# EAGLE design usb2serial (EAGLE 5.06)
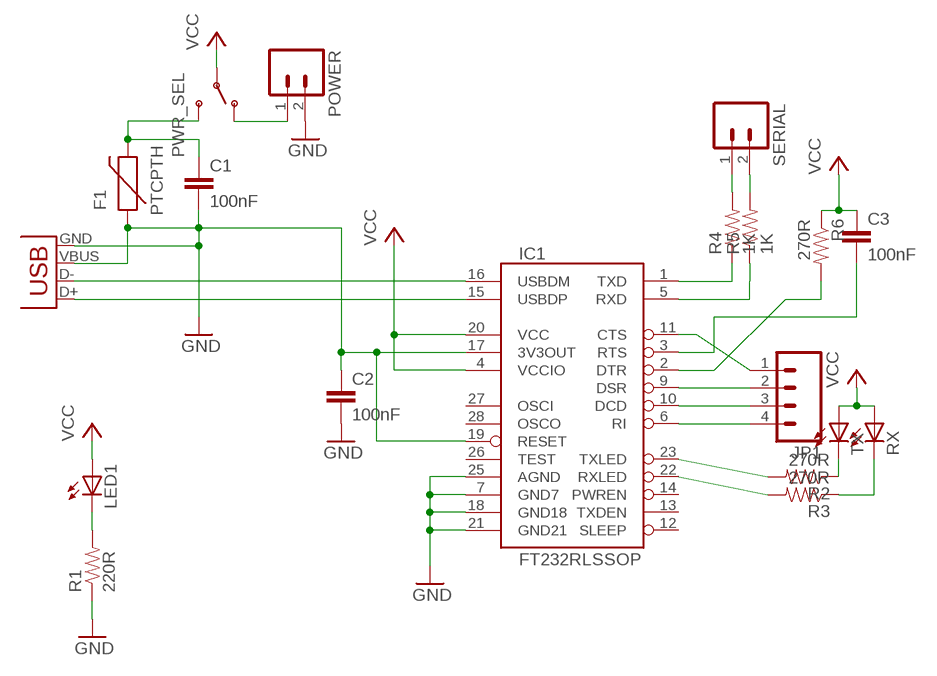
[diagram p0: schematic, sheet 1]

## Parts
C1  100nF  CAPPTH  [CAP-PTH-SMALL]
C2  100nF  CAPPTH  [CAP-PTH-SMALL]
C3  100nF  CAPPTH  [CAP-PTH-SMALL]
F1  PTCPTH  [PTC]
IC1  FT232RLSSOP  [SSOP28DB]
JP1  M04LOCK  [1X04_LOCK]
LED1  LED5MM  [LED5MM]
POWER  M02LOCK  [1X02_LOCK]
PWR_SEL  SWITCH-SPSTPTH_LOCK  [SWITCH-SPDT_LOCK.007S]
R1  220R  RESISTORPTH1  [AXIAL-0.3]
R2  270R  RESISTORPTH1  [AXIAL-0.3]
R3  270R  RESISTORPTH1  [AXIAL-0.3]
R4  1K  RESISTORPTH1  [AXIAL-0.3]
R5  1K  RESISTORPTH1  [AXIAL-0.3]
R6  270R  RESISTORPTH1  [AXIAL-0.3]
RX  LED5MM  [LED5MM]
SERIAL  M02LOCK  [1X02_LOCK]
TX  LED5MM  [LED5MM]
X1  USBSMD  [USB-MINIB]

## Nets
GND: C1.2 C2.1 C2.2 F1.P$1 IC1.7(GND7) IC1.17(3V3OUT) IC1.18(GND18) IC1.19(RESET) IC1.21(GND21) IC1.25(AGND) POWER.2 R1.P$1 X1.GND X1.VBUS
N$1: IC1.15(USBDP) X1.D+
N$2: IC1.16(USBDM) X1.D-
N$3: C1.1 F1.P$2 PWR_SEL.3(S)
N$4: R4.P$2 SERIAL.1
N$5: POWER.1 PWR_SEL.1(O)
N$6: R5.P$2 SERIAL.2
N$7: LED1.K(C) R1.P$2
N$9: C3.2 IC1.3(RTS)
N$10: IC1.22(RXLED) R3.P$2
N$11: IC1.23(TXLED) R2.P$2
N$12: IC1.2(DTR) R6.P$2
N$13: R2.P$1 TX.K(C)
N$14: R3.P$1 RX.K(C)
N$15: IC1.1(TXD) R4.P$1
N$16: IC1.5(RXD) R5.P$1
N$17: IC1.11(CTS) JP1.1
N$18: IC1.6(RI) JP1.4
N$19: IC1.10(DCD) JP1.3
N$20: IC1.9(DSR) JP1.2
VCC: C3.1 IC1.4(VCCIO) IC1.20(VCC) LED1.A PWR_SEL.2(P) R6.P$1 RX.A TX.A
Unconnected: IC1.12(SLEEP) IC1.13(TXDEN) IC1.14(PWREN) IC1.26(TEST) IC1.27(OSCI) IC1.28(OSCO)

## Library data of the parts
C1-C3 = SparkFun:CAP: Capacitor Standard 0603 ceramic capacitor, and 0.1" leaded capacitor.
F1 = SparkFun:PTC: Resettable Fuse PTC Resettable Fuse. Spark Fun Electronics SKU : COM-08357
IC1 = SparkFun:FT232RL: USB UART FT232RL 4th Generation USB UART (USB <-> Serial) Controller. Spark Fun Electronics SKU : COM-00650
JP1 = SparkFun:M04: Header 4 Standard 4-pin 0.1" header. Use with straight break away headers (SKU : PRT-00116), right angle break away headers (PRT-00553), swiss pins (PRT-00743), machine pins (PRT-00117), and female headers (PRT-00115). Molex polarized connector foot print use with SKU : PRT-08231 with associated crimp pins and housings.
LED1 RX TX = led:LED: LED OSRAM: - CHIPLED LG R971, LG N971, LY N971, LG Q971, LY Q971, LO R971, LY R971 LH N974, LH R974 LS Q976, LO Q976, LY Q976 LO Q996 - Hyper CHIPLED LW Q18S LB Q993, LB Q99A, LB R99A - SideLED LS A670, LO A670, LY A670, LG A670, LP A670 LB A673, LV A673, LT A673, LW A673 LH A674 LY A675 LS A676, LA A676, LO A676, LY A676, LW A676 LS A679, LY A679, LG A679 - Hyper Micro SIDELED® LS Y876, LA Y876, LO Y876, LY Y876 LT Y87S - SmartLED LW L88C, LW L88S LB L89C, LB L89S, LG L890 LS L89K, LO L89K, LY L89K LS L896, LA L896, LO L896, LY L896 - TOPLED LS T670, LO T670, LY T670, LG T670, LP T670 LSG T670, LSP T670, LSY T670, LOP T670, LYG T670 LG T671, LOG T671, LSG T671 LB T673, LV T673, LT T673, LW T673 LH T674 LS T676, LA T676, LO T676, LY T676, LB T676, LH T676, LSB T676, LW T676 LB T67C, LV T67C, LT T67C, LS T67K, LO T67K, LY T67K, LW E67C LS E67B, LA E67B, LO E67B, LY E67B, LB E67C, LV E67C, LT E67C LW T67C LS T679, LY T679, LG T679 LS T770, LO T770, LY T770, LG T770, LP T770 LB T773, LV T773, LT T773, LW T773 LH T774 LS E675, LA E675, LY E675, LS T675 LS T776, LA T776, LO T776, LY T776, LB T776 LHGB T686 LT T68C, LB T68C - Hyper Mini TOPLED® LB M676 - Mini TOPLED Santana® LG M470 LS M47K, LO M47K, LY M47K Source: http://www.osram.convergy.de LUXEON: - LUMILED® LXK2-PW12-R00, LXK2-PW12-S00, LXK2-PW14-U00, LXK2-PW14-V00 LXK2-PM12-R00, LXK2-PM12-S00, LXK2-PM14-U00 LXK2-PE12-Q00, LXK2-PE12-R00, LXK2-PE12-S00, LXK2-PE14-T00, LXK2-PE14-U00 LXK2-PB12-K00, LXK2-PB12-L00, LXK2-PB12-M00, LXK2-PB14-N00, LXK2-PB14-P00, LXK2-PB14-Q00 LXK2-PR12-L00, LXK2-PR12-M00, LXK2-PR14-Q00, LXK2-PR14-R00 LXK2-PD12-Q00, LXK2-PD12-R00, LXK2-PD12-S00 LXK2-PH12-R00, LXK2-PH12-S00 LXK2-PL12-P00, LXK2-PL12-Q00, LXK2-PL12-R00 Source: www.luxeon.com KINGBRIGHT: KA-3528ASYC Source: www.kingbright.com
POWER SERIAL = SparkFun:M02: Header 2 Standard 2-pin 0.1" header. Use with straight break away headers (SKU : PRT-00116), right angle break away headers (PRT-00553), swiss pins (PRT-00743), machine pins (PRT-00117), and female headers (PRT-00115). Molex polarized connector foot print use with SKU : PRT-08233 with associated crimp pins and housings.
PWR_SEL = SparkFun:SWITCH-SPST: SPST Switch Simple slide switch. Spark Fun Electronics SKU : COM-00102
R1-R6 = SparkFun:RESISTOR: Resistor Basic schematic elements and footprints for 0603, 1206, and PTH 1/10th watt (small) resistors.
X1 = SparkFun:USB: USB Connectors USB-B-PTH is fully proven SKU : PRT-00139 USB-miniB is fully proven SKU : PRT-00587 USB-A-PCB is untested. USB-A-H is throughly reviewed, but untested. Spark Fun Electronics SKU : PRT-00437 USB-B-SMT is throughly reviewed, but untested. Needs silkscreen touching up. USB-A-S has not been used/tested USB-MB-H has not been used/tested

## Board
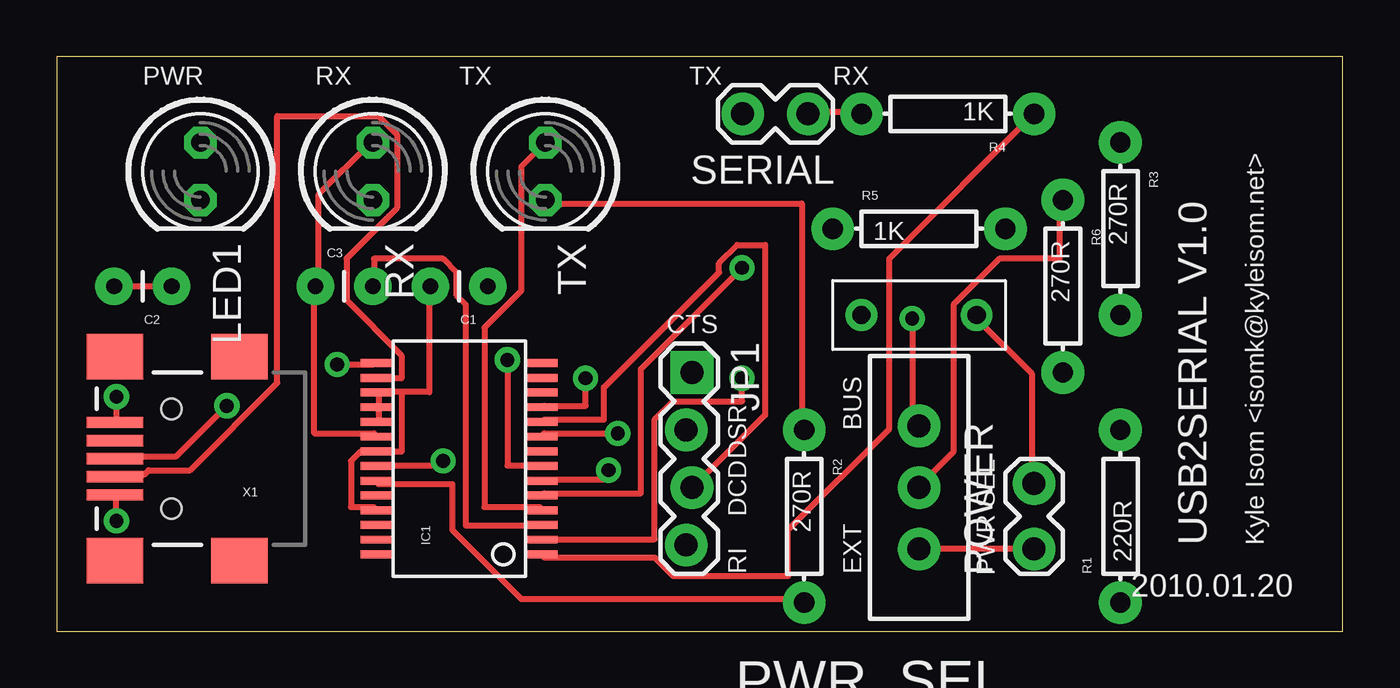
[diagram p1: board, top side]
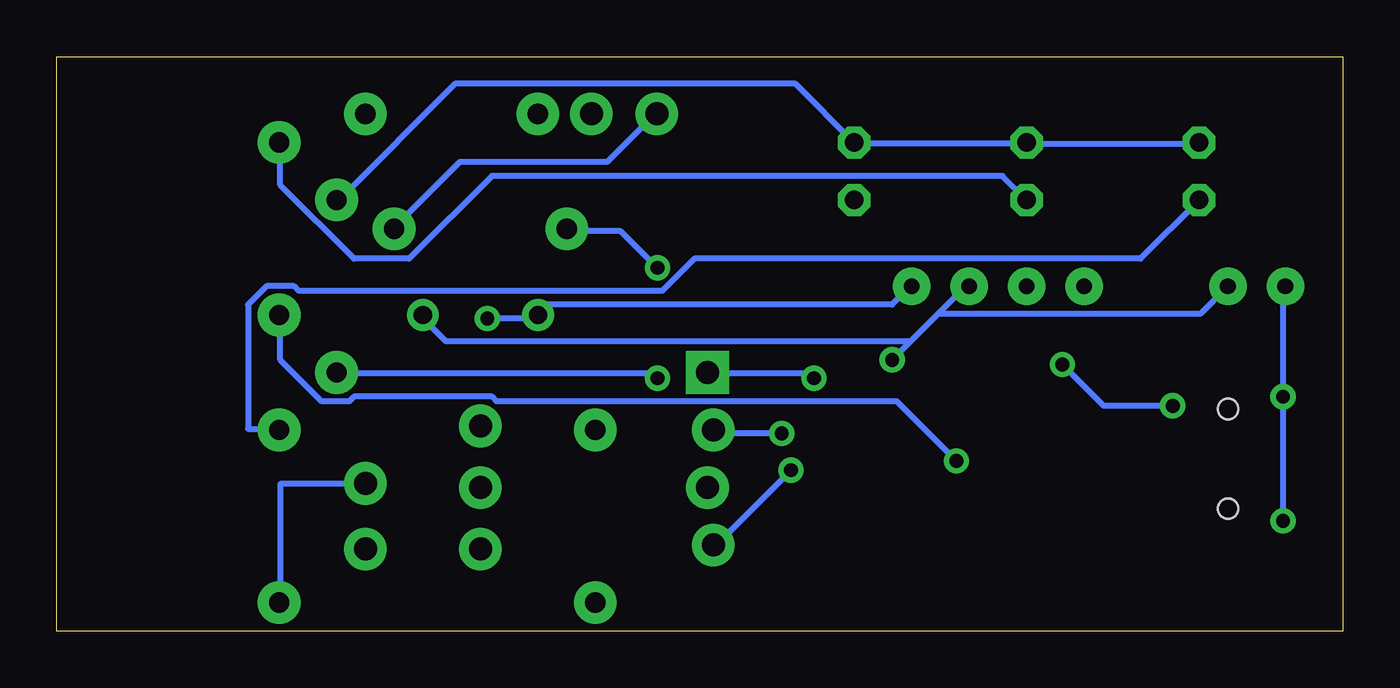
[diagram p2: board, bottom side, seen from below]

Size 56.82 x 25.39 mm. Coordinates in mm from the lower left corner, seen from the top.
Outline: 0,0 56.82,0 56.82,25.39 0,25.39 0,0
Copper layers (1*16): Top 0.035mm / dielectric 1.5mm / Bottom 0.035mm
Design rules "SparkFun": minimum track width 8mil, minimum drill 20mil, track to track 8mil, track to pad 8mil, pad to pad 8mil, via to via 8mil, smd to smd 8mil, copper to edge 10mil, drill to drill 8mil, minimum pad ring 12mil, minimum via ring 10mil, stop-mask expansion 4mil, vias tented up to drill 25mil, thermal gap 10mil

### Footprints (pad centres in the part's own frame; a part is rotated, then mirrored left to right if it is on the bottom)
CAP-PTH-SMALL = drill 0.7 pad 1.651 round: 1 0,0; 2 2.54,0
PTC = drill 0.8 round: P$1 -2.54,0; P$2 2.54,0
SSOP28DB = smd 0.348 x 1.397: 1 -4.225,-3.656; 2 -3.575,-3.656; 3 -2.925,-3.656; 4 -2.275,-3.656; 5 -1.625,-3.656; 6 -0.975,-3.656; 7 -0.325,-3.656; 8 0.325,-3.656; 9 0.975,-3.656; 10 1.625,-3.656; 11 2.275,-3.656; 12 2.925,-3.656; 13 3.575,-3.656; 14 4.225,-3.656; 15 4.225,3.656; 16 3.575,3.656; 17 2.925,3.656; 18 2.275,3.656; 19 1.625,3.656; 20 0.975,3.656; 21 0.325,3.656; 22 -0.325,3.656; 23 -0.975,3.656; 24 -1.625,3.656; 25 -2.275,3.656; 26 -2.925,3.656; 27 -3.575,3.656; 28 -4.225,3.656
1X04_LOCK = drill 1.016 pad 1.88 square: 1 0,0.127 | drill 1.016 pad 1.88 round: 2 2.54,-0.127; 3 5.08,0.127; 4 7.62,-0.127
LED5MM = drill 0.813 octagon: A -1.27,0; K 1.27,0
1X02_LOCK = drill 1.016 pad 1.88 round: 1 -0.178,0; 2 2.718,0
SWITCH-SPDT_LOCK.007S = drill 1.016 pad 1.88 round: 1 0,2.718; 2 0,0; 3 0,-2.718
AXIAL-0.3 = drill 0.9 pad 1.88 round: P$1 -3.81,0; P$2 3.81,0
USB-MINIB = smd 2.5 x 0.5: D+ 2.5,0; D- 2.5,0.8; GND 2.5,-1.6; ID 2.5,-0.8; VBUS 2.5,1.6 | smd 2.5 x 2: GND@1 -3,-4.5; GND@2 -3,4.5; GND@3 2.5,4.5; GND@4 2.5,-4.5 | hole 0.9: 0,2.2; 0,-2.2

### Placement (x,y rotation side)
C1  19.05,15.24 180 top
C2  5.08,15.24 180 top
C3  11.43,15.24 0 top
F1  38.1,13.97 180 top
IC1  17.78,7.62 90 top
JP1  27.94,11.43 270 top
LED1  6.35,20.32 270 top
POWER  43.18,3.81 90 top
PWR_SEL  38.1,6.35 180 top
R1  46.99,5.08 90 top
R2  33.02,5.08 270 top
R3  46.99,17.78 270 top
R4  39.37,22.86 180 top
R5  38.1,17.78 0 top
R6  44.45,15.24 270 top
RX  13.97,20.32 270 top
SERIAL  33.02,22.86 180 top
TX  21.59,20.32 270 top
X1  5.08,7.62 180 top

### Tracks (layer width: path | path; a pad name or v marks a point on that pad's centre or on a via)
GND  (via drill 0.61)
  Top 0.254: F1.P$1 40.64,13.82 43.08,11.38 43.08,6.71 POWER.2 | v2.64,4.88 2.64,5.89 X1.VBUS | v2.64,10.36 2.64,9.35 X1.GND | C2.2 C2.1 | IC1.25 14.02,5.49 13.01,5.49 13.01,7.52 13.41,7.92 14.02,7.92 IC1.21 14.22,7.92 15.24,7.92 15.24,10.57 | IC1.19 14.22,9.35 14.22,9.75 IC1.18 14.22,9.96 14.22,10.57 | v19.91,11.99 19.91,7.32 21.34,7.32 IC1.7 | 15.24,10.57 16.46,10.57 16.46,15.24 C1.2 | 15.24,10.57 14.22,10.57 | 14.22,10.57 IC1.17
  Bottom 0.254: R1.P$1 46.94,1.42 46.94,6.5 43.28,6.5 POWER.2 | v2.64,4.88 v2.64,10.36 2.64,15.24 C2.2 | 17.88,14.02 16.66,15.24 C1.2 | 17.88,14.02 19.1,12.8 | 19.1,12.8 v19.91,11.99 | C2.1 6.3,14.02 17.88,14.02 | 19.1,12.8 39.62,12.8 40.64,13.82 F1.P$1
N$1  (via drill 0.61)
  Top 0.254: v12.39,11.79 14.02,11.79 IC1.15 | v7.52,9.96 5.28,7.72 2.64,7.72 X1.D+
  Bottom 0.254: v12.39,11.79 10.57,9.96 v7.52,9.96
N$2
  Top 0.254: IC1.16 14.22,11.18 15.24,11.18 15.24,12.19 12.8,14.63 12.8,16.46 15.04,18.69 15.04,21.95 14.22,22.76 9.75,22.76 9.75,10.97 5.89,7.11 4.06,7.11 3.86,6.91 2.64,6.91 X1.D-
N$3  (via drill 0.61)
  Top 0.254: v37.8,13.82 37.8,9.35 38,9.14 PWR_SEL.3
  Bottom 0.254: C1.1 19.1,15.24 19.91,14.43 35.15,14.43 35.56,14.02 F1.P$2 35.56,13.82 v37.8,13.82
N$4
  Top 0.254: SERIAL.1 33.33,22.96 35.56,22.96 R4.P$2
N$5
  Top 0.254: PWR_SEL.1 38.2,3.66 43.08,3.66 POWER.1
N$6
  Bottom 0.254: SERIAL.2 30.48,22.76 32.51,20.73 39.01,20.73 41.86,17.88 R5.P$2
N$7
  Bottom 0.254: LED1.K 8.94,16.46 28.65,16.46 30.07,15.04 46.13,15.04 46.33,15.24 47.55,15.24 48.36,14.43 48.36,8.94 47.14,8.94 R1.P$2
N$9
  Top 0.254: IC1.3 21.34,4.67 18.09,4.67 18.09,14.43 17.68,14.83 17.68,15.85 17.07,16.46 14.02,16.46 14.02,15.24 C3.2
N$10  (via drill 0.61)
  Top 0.254: v17.07,7.52 17.07,7.32 14.22,7.32 IC1.22
  Bottom 0.254: v17.07,7.52 19.71,10.16 37.39,10.16 37.59,10.36 43.69,10.36 43.89,10.16 45.11,10.16 46.94,11.99 46.94,13.82 R3.P$2
N$11
  Top 0.254: IC1.23 14.22,6.5 17.48,6.5 17.48,4.47 20.52,1.42 32.92,1.42 R2.P$2
N$12  (via drill 0.61)
  Top 0.254: v30.28,11.18 30.28,10.16 27.23,10.16 26.42,9.35 26.42,4.06 21.54,4.06 IC1.2
  Bottom 0.254: v30.28,11.18 30.48,11.38 44.3,11.38 R6.P$2
N$13
  Top 0.254: TX.K 21.74,18.9 32.92,18.9 32.92,8.94 R2.P$1
N$14
  Bottom 0.254: RX.K 15.04,20.12 37.59,20.12 41.25,16.46 43.69,16.46 46.94,19.71 46.94,21.54 R3.P$1
N$15
  Top 0.254: IC1.1 21.54,3.25 26.42,3.25 27.23,2.44 32.31,2.44 32.31,4.47 36.78,8.94 36.78,16.46 R4.P$1
N$16  (via drill 0.61)
  Top 0.254: v30.28,16.05 25.81,11.58 25.81,6.1 21.54,6.1 IC1.5
  Bottom 0.254: v30.28,16.05 31.9,17.68 34.14,17.68 R5.P$1
N$17  (via drill 0.61)
  Top 0.254: v23.37,11.18 23.37,9.96 21.54,9.96 IC1.11
  Bottom 0.254: v23.37,11.18 23.57,11.38 28.04,11.38 JP1.1
N$18  (via drill 0.61)
  Top 0.254: v24.38,7.11 24.38,6.71 21.54,6.71 IC1.6
  Bottom 0.254: v24.38,7.11 27.64,3.86 JP1.4
N$19
  Top 0.254: IC1.10 21.54,9.35 24.18,9.35 24.18,10.77 29.26,15.85 29.26,16.26 30.07,17.07 31.29,17.07 31.29,9.55 28.25,6.5 JP1.3
N$20  (via drill 0.61)
  Top 0.254: v24.79,8.74 21.54,8.74 IC1.9
  Bottom 0.254: v24.79,8.74 27.64,8.74 JP1.2
VCC
  Top 0.254: PWR_SEL.2 38.2,6.5 39.62,7.92 39.62,14.43 41.66,16.46 44.3,16.46 44.3,18.9 R6.P$1 | IC1.4 21.34,5.49 18.9,5.49 18.9,13.41 20.52,15.04 20.52,20.52 TX.A | IC1.20 14.02,8.74 11.38,8.74 11.38,15.24 C3.1 11.58,15.24 11.58,19.3 13.82,21.54 RX.A
  Bottom 0.254: LED1.A 6.5,21.54 13.82,21.54 RX.A 14.02,21.54 21.54,21.54 TX.A 24.18,24.18 39.22,24.18 44.3,19.1 R6.P$1

### Text on the board
tPlace: PWR | RX | TX | TX | RX | CTS | BUS | DSR | PWR SEL | DCD | USB2SERIAL V1.0 | Kyle Isom <isomk@kyleisom.net> | RI | EXT | 2010.01.20